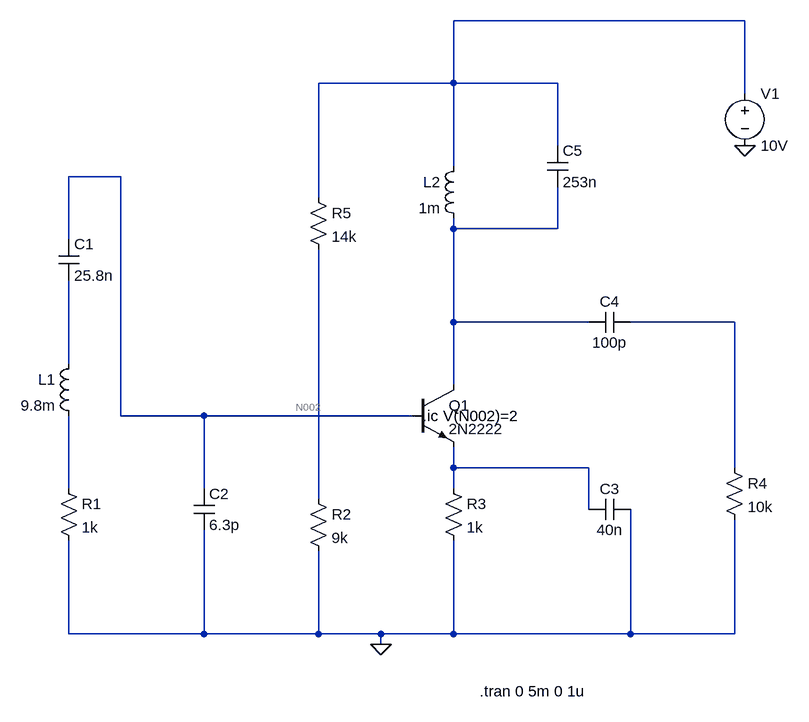
[diagram p0: schematic tuned collector oscillator.asc]
tuned collector oscillator.asc, the LTspice schematic file:
Version 4.1
SHEET 1 1176 776
WIRE 1104 -272 656 -272
WIRE 656 -176 656 -272
WIRE 656 -176 448 -176
WIRE 816 -176 656 -176
WIRE 1104 -160 1104 -272
WIRE 816 -80 816 -176
WIRE 656 -48 656 -176
WIRE 144 -32 64 -32
WIRE 448 0 448 -176
WIRE 656 48 656 32
WIRE 816 48 816 -16
WIRE 816 48 656 48
WIRE 64 64 64 -32
WIRE 656 192 656 48
WIRE 864 192 656 192
WIRE 1088 192 928 192
WIRE 64 256 64 128
WIRE 656 288 656 192
WIRE 144 336 144 -32
WIRE 272 336 144 336
WIRE 592 336 272 336
WIRE 656 416 656 384
WIRE 864 416 656 416
WIRE 1088 416 1088 192
WIRE 64 448 64 336
WIRE 272 448 272 336
WIRE 656 448 656 416
WIRE 448 464 448 80
WIRE 864 480 864 416
WIRE 64 672 64 528
WIRE 272 672 272 512
WIRE 272 672 64 672
WIRE 448 672 448 544
WIRE 448 672 272 672
WIRE 544 672 448 672
WIRE 656 672 656 528
WIRE 656 672 544 672
WIRE 928 672 928 480
WIRE 928 672 656 672
WIRE 1088 672 1088 496
WIRE 1088 672 928 672
WIRE 544 688 544 672
FLAG 1104 -80 0
FLAG 544 688 0
SYMBOL cap 48 64 R0
SYMATTR InstName C1
SYMATTR Value 25.8n
SYMBOL ind 80 240 M0
SYMATTR InstName L1
SYMATTR Value 9.8m
SYMBOL res 48 432 R0
SYMATTR InstName R1
SYMATTR Value 1k
SYMBOL cap 256 448 R0
SYMATTR InstName C2
SYMATTR Value 6.3p
SYMBOL res 432 448 R0
SYMATTR InstName R2
SYMATTR Value 9k
SYMBOL npn 592 288 R0
SYMATTR InstName Q1
SYMATTR Value 2N2222
SYMBOL res 640 432 R0
SYMATTR InstName R3
SYMATTR Value 1k
SYMBOL cap 928 464 R90
WINDOW 0 0 32 VBottom 2
WINDOW 3 32 32 VTop 2
SYMATTR InstName C3
SYMATTR Value 40n
SYMBOL res 1072 400 R0
SYMATTR InstName R4
SYMATTR Value 10k
SYMBOL cap 928 176 R90
WINDOW 0 0 32 VBottom 2
WINDOW 3 32 32 VTop 2
SYMATTR InstName C4
SYMATTR Value 100p
SYMBOL res 432 -16 R0
SYMATTR InstName R5
SYMATTR Value 14k
SYMBOL ind 672 -64 M0
SYMATTR InstName L2
SYMATTR Value 1m
SYMBOL cap 800 -80 R0
SYMATTR InstName C5
SYMATTR Value 253n
SYMBOL voltage 1104 -176 R0
WINDOW 123 0 0 Left 0
WINDOW 39 0 0 Left 0
SYMATTR InstName V1
SYMATTR Value 10V
TEXT 608 336 Left 2 !.ic V(N002)=2
TEXT 696 760 Left 2 !.tran 0 5m 0 1u

The netlist it stands for:
* tuned collector oscillator.asc
C1 N002 N005 25.8n
L1 N005 N007 9.8m
R1 N007 0 1k
C2 N002 0 6.3p
R2 N008 0 9k
Q1 N003 N002 N006 0 2N2222
R3 N006 0 1k
C3 0 N006 40n
R4 N004 0 10k
C4 N004 N003 100p
R5 N001 N008 14k
L2 N001 N003 1m
C5 N001 N003 253n
V1 N001 0 10V
.model NPN NPN
.model PNP PNP
.lib standard.bjt
.ic V(N002)=2
.tran 0 5m 0 1u
.backanno
.end